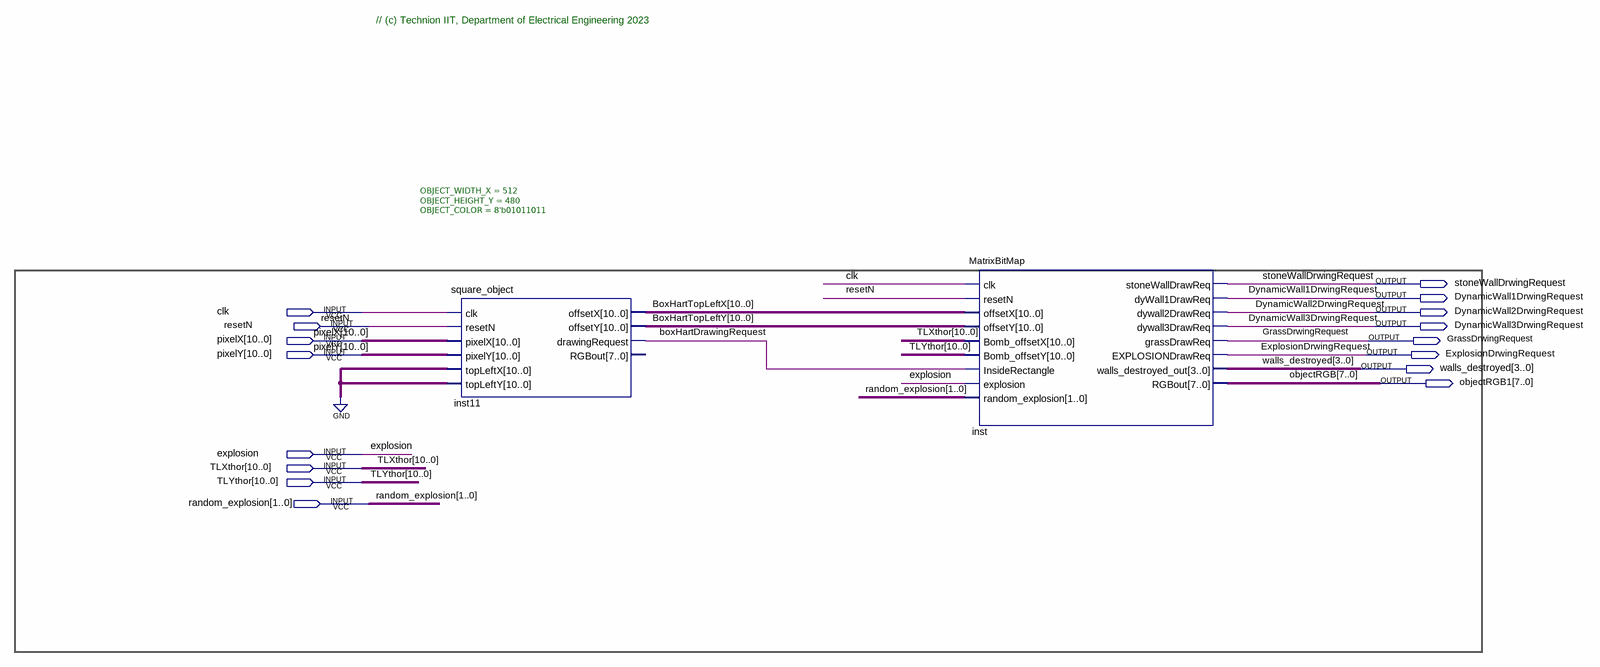
[diagram p0: schematic sheet]
// Quartus schematic Matrix_DISPLAY.bdf as structural Verilog: 2 symbols, 16 pins
module Matrix_DISPLAY (
  input  clk,
  input  resetN,
  input  [10:0] pixelX,
  input  [10:0] pixelY,
  input  explosion,
  input  [10:0] TLXthor,
  input  [10:0] TLYthor,
  input  [1:0] random_explosion,
  output stoneWallDrwingRequest,
  output DynamicWall1DrwingRequest,
  output DynamicWall2DrwingRequest,
  output DynamicWall3DrwingRequest,
  output GrassDrwingRequest,
  output ExplosionDrwingRequest,
  output [3:0] walls_destroyed,
  output [7:0] objectRGB1
);

  wire boxHartDrawingRequest;
  wire [10:0] BoxHartTopLeftX, BoxHartTopLeftY;

  square_object #(.OBJECT_WIDTH_X(512), .OBJECT_HEIGHT_Y(480), .OBJECT_COLOR(8'b01011011)) inst11 (
    .clk(clk), .resetN(resetN), .pixelX(pixelX), .pixelY(pixelY), .topLeftX({11{1'b0}}),
    .topLeftY({11{1'b0}}), .offsetX(BoxHartTopLeftX), .offsetY(BoxHartTopLeftY),
    .drawingRequest(boxHartDrawingRequest));  // open: RGBout
  MatrixBitMap inst (
    .clk(clk), .resetN(resetN), .offsetX(BoxHartTopLeftX), .offsetY(BoxHartTopLeftY), .Bomb_offsetX(TLXthor),
    .Bomb_offsetY(TLYthor), .InsideRectangle(boxHartDrawingRequest), .explosion(explosion),
    .random_explosion(random_explosion), .stoneWallDrawReq(stoneWallDrwingRequest),
    .dyWall1DrawReq(DynamicWall1DrwingRequest), .dywall2DrawReq(DynamicWall2DrwingRequest),
    .dywall3DrawReq(DynamicWall3DrwingRequest), .grassDrawReq(GrassDrwingRequest),
    .EXPLOSIONDrawReq(ExplosionDrwingRequest), .walls_destroyed_out(walls_destroyed), .RGBout(objectRGB1));

  // Other names for the same wires on the sheet: objectRGB[7:0] = objectRGB1

  // Notes on the sheet:
  //   // (c) Technion IIT, Department of Electrical Engineering 2023
endmodule
